# Altium schematic sheet MCU.SchDoc
size A4
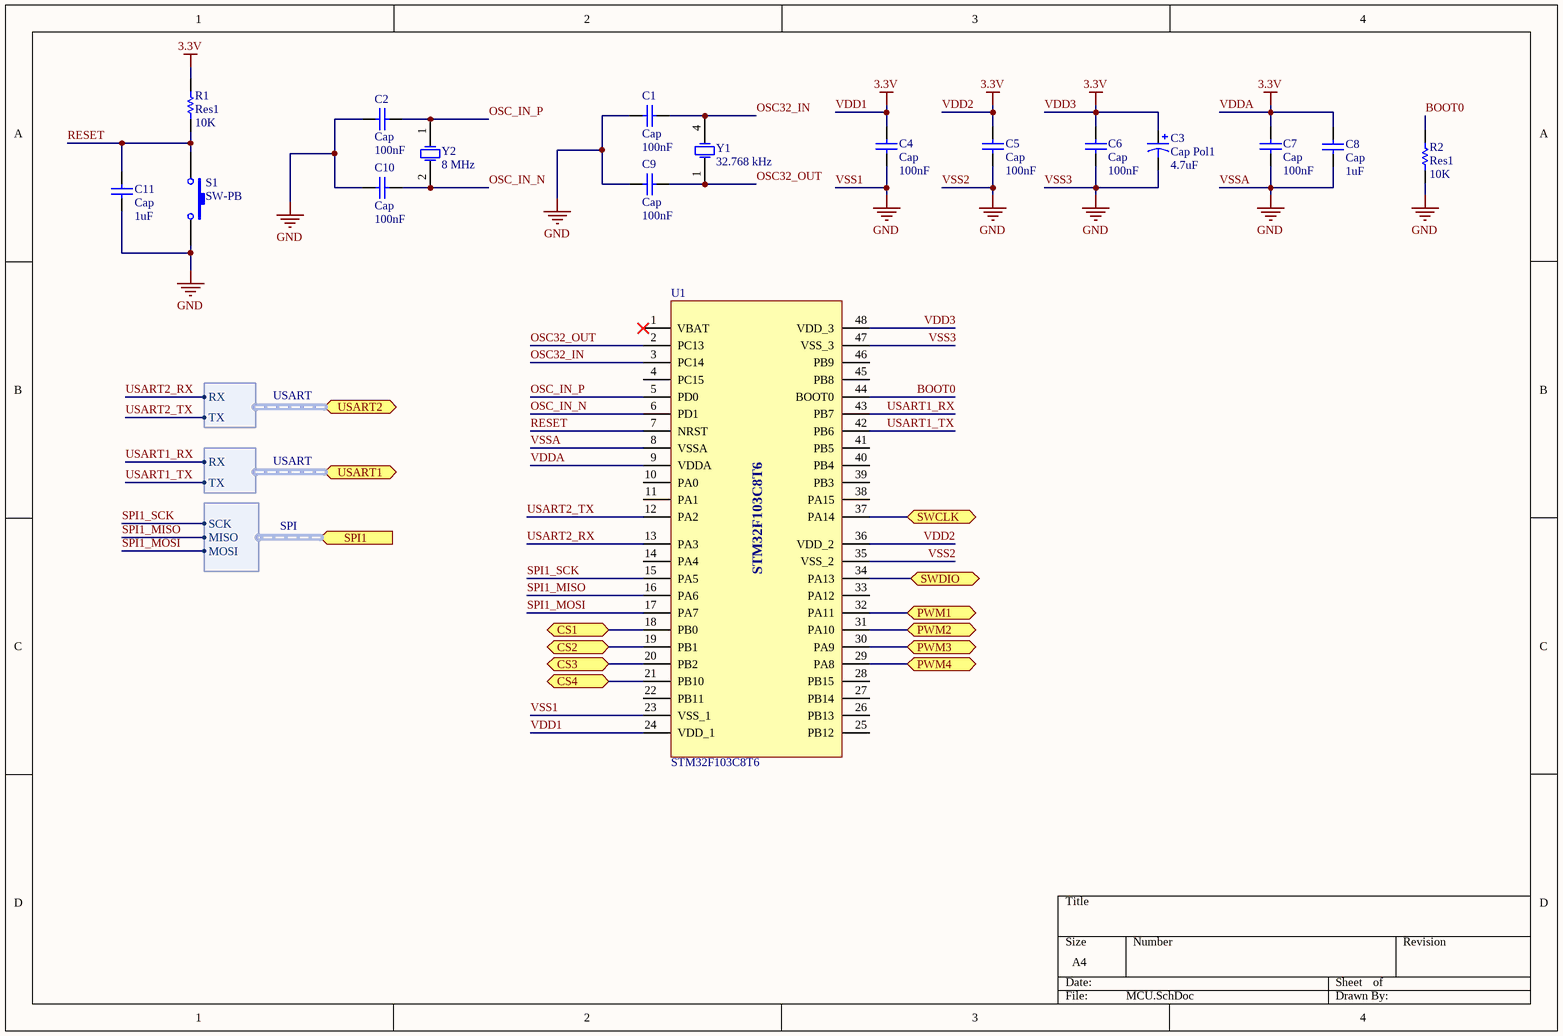
[diagram p0: MCU.SchDoc]

## Parts
C1  Cap  value 100nF  [0805-CAP]
C2  Cap  value 100nF  [0805-CAP]
C3  Cap Pol1  value 4.7uF  [Tantalum A-Case]
C4  Cap  value 100nF  [0805-CAP]
C5  Cap  value 100nF  [0805-CAP]
C6  Cap  value 100nF  [0805-CAP]
C7  Cap  value 100nF  [0805-CAP]
C8  Cap  value 1uF  [0805-CAP]
C9  Cap  value 100nF  [0805-CAP]
C10  Cap  value 100nF  [0805-CAP]
C11  Cap  value 1uF  [0805-CAP]
R1  Res1  value 10K  [0805-RES]
R2  Res1  value 10K  [0805-RES]
S1  SW-PB  [3x6x2.5mm Tacticle Push Button]
U1  STM32F103C8T6  [LQFP-48]
Y1  32.768 kHz  [MC-306 SMD]
Y2  8 MHz  [HC49 Crystal SMD]

## Ports
CS1, CS2, CS3, CS4, PWM1, PWM2, PWM3, PWM4, SPI1 (harness SPI), SWCLK, SWDIO, USART1 (harness USART), USART2 (harness USART)

## Harnesses
USART: TX, RX
SPI: SCK, MISO, MOSI

## Nets
VDD1: C3.1 C4.2 C5.2 C6.2 C7.2 C8.2 R1.2 U1.9(VDDA) U1.24(VDD_1) U1.36(VDD_2) U1.48(VDD_3)  [also labelled 3.3V, VDD2, VDD3, VDDA]
VSS1: C1.2 C2.2 C3.2 C4.1 C5.1 C6.1 C7.1 C8.1 C9.2 C10.2 C11.1 R2.1 S1.2 U1.8(VSSA) U1.23(VSS_1) U1.35(VSS_2) U1.47(VSS_3)  [also labelled GND, VSS2, VSS3, VSSA]
BOOT0: R2.2 U1.44(BOOT0)
CS1: U1.18(PB0) ; port CS1
CS2: U1.19(PB1) ; port CS2
CS3: U1.20(PB2) ; port CS3
CS4: U1.21(PB10) ; port CS4
OSC32_IN: C1.1 U1.3(PC14) Y1.4(OSC2)
OSC32_OUT: C9.1 U1.2(PC13) Y1.1(OSC1)
OSC_IN_N: C10.1 U1.6(PD1) Y2.2(OSC2)
OSC_IN_P: C2.1 U1.5(PD0) Y2.1(OSC1)
PWM1: U1.32(PA11) ; port PWM1
PWM2: U1.31(PA10) ; port PWM2
PWM3: U1.30(PA9) ; port PWM3
PWM4: U1.29(PA8) ; port PWM4
RESET: C11.2 R1.1 S1.1 U1.7(NRST)
SPI1_MISO: U1.16(PA6) ; port SPI1.MISO
SPI1_MOSI: U1.17(PA7) ; port SPI1.MOSI
SPI1_SCK: U1.15(PA5) ; port SPI1.SCK
SWCLK: U1.37(PA14) ; port SWCLK
SWDIO: U1.34(PA13) ; port SWDIO
USART1_RX: U1.43(PB7) ; port USART1.RX
USART1_TX: U1.42(PB6) ; port USART1.TX
USART2_RX: U1.13(PA3) ; port USART2.RX
USART2_TX: U1.12(PA2) ; port USART2.TX

Not connected (* = marked no-connect by the designer): U1 1(VBAT)* 4(PC15) 10(PA0) 11(PA1) 14(PA4) 22(PB11) 25(PB12) 26(PB13) 27(PB14) 28(PB15) 33(PA12) 38(PA15) 39(PB3) 40(PB4) 41(PB5) 45(PB8) 46(PB9)

## Library data of the parts
C1 C2 C4-C11 = Cap: Capacitor; Published: 8-Jun-2000; LatestRevisionDate: 17-Jul-2002; LatestRevisionNote: Re-released for DXP Platform.; PackageReference: RAD-0.3; Publisher: Altium Limited; PackageDescription: Radial Cap, Thru-Hole; 2 Leads; 0.3 in Pin Spacing
C3 = Cap Pol1: Polarized Capacitor (Radial); Published: 8-Jun-2000; LatestRevisionDate: 17-Jul-2002; LatestRevisionNote: Re-released for DXP Platform.; PackageReference: RB7.6-15; Publisher: Altium Limited; PackageDescription: Polarized Capacitor (Radial); 2 Leads
R1 R2 = Res1: Resistor; Published: 8-Jun-2000; LatestRevisionDate: 17-Jul-2002; LatestRevisionNote: Re-released for DXP Platform.; PackageReference: AXIAL-0.3; Publisher: Altium Limited; PackageDescription: Axial Device, Thru-Hole; 2 Leads; 0.3 in Pin Spacing
S1 = SW-PB: Switch; Published: 24-Mar-1999; LatestRevisionDate: 17-Jul-2002; LatestRevisionNote: Re-released for DXP Platform.; PackageReference: SPST-2; Publisher: Altium Limited; PackageDescription: Switch; 2 Leads
U1 = STM32F103C8T6-LQPF48: STM32F103C8T6 LQPF-48
Y1 Y2 = XTAL: Crystal Oscillator; Published: 8-Jun-2000; LatestRevisionDate: 17-Jul-2002; LatestRevisionNote: Re-released for DXP Platform.; PackageReference: R38; Publisher: Altium Limited; PackageDescription: Crystal, Thru-Hole; 2 Leads; Body 3.1 x 8.2 mm (Dia.xH)